# EAGLE design eLite Clock - Display Boards (EAGLE 9.6.0)
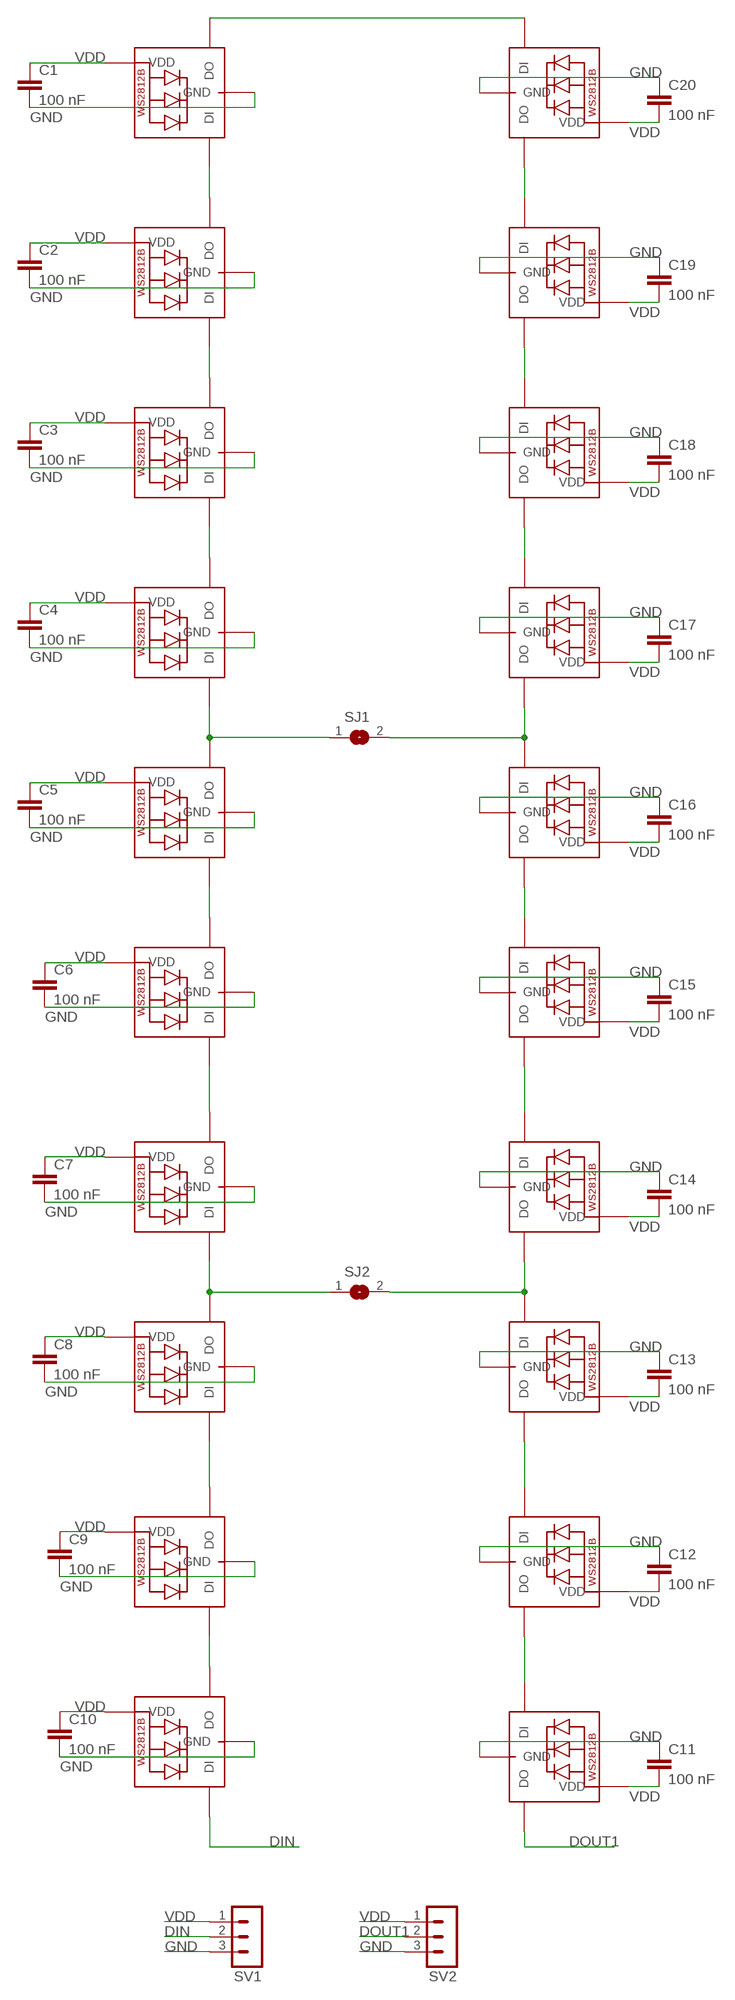
[diagram p0: schematic, sheet 1]

## Parts
C1  100 nF  C-EU025-025X050  [C025-025X050]
C2  100 nF  C-EU025-025X050  [C025-025X050]
C3  100 nF  C-EU025-025X050  [C025-025X050]
C4  100 nF  C-EU025-025X050  [C025-025X050]
C5  100 nF  C-EU025-025X050  [C025-025X050]
C6  100 nF  C-EU025-025X050  [C025-025X050]
C7  100 nF  C-EU025-025X050  [C025-025X050]
C8  100 nF  C-EU025-025X050  [C025-025X050]
C9  100 nF  C-EU025-025X050  [C025-025X050]
C10  100 nF  C-EU025-025X050  [C025-025X050]
C11  100 nF  C-EU025-025X050  [C025-025X050]
C12  100 nF  C-EU025-025X050  [C025-025X050]
C13  100 nF  C-EU025-025X050  [C025-025X050]
C14  100 nF  C-EU025-025X050  [C025-025X050]
C15  100 nF  C-EU025-025X050  [C025-025X050]
C16  100 nF  C-EU025-025X050  [C025-025X050]
C17  100 nF  C-EU025-025X050  [C025-025X050]
C18  100 nF  C-EU025-025X050  [C025-025X050]
C19  100 nF  C-EU025-025X050  [C025-025X050]
C20  100 nF  C-EU025-025X050  [C025-025X050]
LED1  WS2812B_5050W  [WS2812B-WIDE]
LED2  WS2812B_5050W  [WS2812B-WIDE]
LED3  WS2812B_5050W  [WS2812B-WIDE]
LED4  WS2812B_5050W  [WS2812B-WIDE]
LED5  WS2812B_5050W  [WS2812B-WIDE]
LED6  WS2812B_5050W  [WS2812B-WIDE]
LED7  WS2812B_5050W  [WS2812B-WIDE]
LED8  WS2812B_5050W  [WS2812B-WIDE]
LED9  WS2812B_5050W  [WS2812B-WIDE]
LED10  WS2812B_5050W  [WS2812B-WIDE]
LED11  WS2812B_5050W  [WS2812B-WIDE]
LED12  WS2812B_5050W  [WS2812B-WIDE]
LED13  WS2812B_5050W  [WS2812B-WIDE]
LED14  WS2812B_5050W  [WS2812B-WIDE]
LED15  WS2812B_5050W  [WS2812B-WIDE]
LED16  WS2812B_5050W  [WS2812B-WIDE]
LED17  WS2812B_5050W  [WS2812B-WIDE]
LED18  WS2812B_5050W  [WS2812B-WIDE]
LED19  WS2812B_5050W  [WS2812B-WIDE]
LED20  WS2812B_5050W  [WS2812B-WIDE]
SJ1  SJ  [SJ]
SJ2  SJ  [SJ]
SV1  MA03-1  [MA03-1]
SV2  MA03-1  [MA03-1]

## Nets
DIN: LED1.4-DIN(DI) SV1.2
DOUT1: LED20.2-DOUT(DO) SV2.2
GND: C1.2 C2.2 C3.2 C4.2 C5.2 C6.2 C7.2 C8.2 C9.2 C10.2 C11.1 C12.1 C13.1 C14.1 C15.1 C16.1 C17.1 C18.1 C19.1 C20.1 LED1.3-GND(GND) LED2.3-GND(GND) LED3.3-GND(GND) LED4.3-GND(GND) LED5.3-GND(GND) LED6.3-GND(GND) LED7.3-GND(GND) LED8.3-GND(GND) LED9.3-GND(GND) LED10.3-GND(GND) LED11.3-GND(GND) LED12.3-GND(GND) LED13.3-GND(GND) LED14.3-GND(GND) LED15.3-GND(GND) LED16.3-GND(GND) LED17.3-GND(GND) LED18.3-GND(GND) LED19.3-GND(GND) LED20.3-GND(GND) SV1.3 SV2.3
N$1: LED1.2-DOUT(DO) LED2.4-DIN(DI)
N$2: LED2.2-DOUT(DO) LED3.4-DIN(DI)
N$3: LED3.2-DOUT(DO) LED4.4-DIN(DI) SJ2.1
N$4: LED4.2-DOUT(DO) LED5.4-DIN(DI)
N$5: LED5.2-DOUT(DO) LED6.4-DIN(DI)
N$6: LED6.2-DOUT(DO) LED7.4-DIN(DI) SJ1.1
N$7: LED7.2-DOUT(DO) LED8.4-DIN(DI)
N$8: LED8.2-DOUT(DO) LED9.4-DIN(DI)
N$9: LED9.2-DOUT(DO) LED10.4-DIN(DI)
N$10: LED11.2-DOUT(DO) LED12.4-DIN(DI)
N$11: LED12.2-DOUT(DO) LED13.4-DIN(DI)
N$12: LED13.2-DOUT(DO) LED14.4-DIN(DI)
N$13: LED14.2-DOUT(DO) LED15.4-DIN(DI) SJ1.2
N$14: LED15.2-DOUT(DO) LED16.4-DIN(DI)
N$15: LED16.2-DOUT(DO) LED17.4-DIN(DI)
N$16: LED17.2-DOUT(DO) LED18.4-DIN(DI) SJ2.2
N$17: LED18.2-DOUT(DO) LED19.4-DIN(DI)
N$18: LED19.2-DOUT(DO) LED20.4-DIN(DI)
N$19: LED10.2-DOUT(DO) LED11.4-DIN(DI)
VDD: C1.1 C2.1 C3.1 C4.1 C5.1 C6.1 C7.1 C8.1 C9.1 C10.1 C11.2 C12.2 C13.2 C14.2 C15.2 C16.2 C17.2 C18.2 C19.2 C20.2 LED1.1-VDD(VDD) LED2.1-VDD(VDD) LED3.1-VDD(VDD) LED4.1-VDD(VDD) LED5.1-VDD(VDD) LED6.1-VDD(VDD) LED7.1-VDD(VDD) LED8.1-VDD(VDD) LED9.1-VDD(VDD) LED10.1-VDD(VDD) LED11.1-VDD(VDD) LED12.1-VDD(VDD) LED13.1-VDD(VDD) LED14.1-VDD(VDD) LED15.1-VDD(VDD) LED16.1-VDD(VDD) LED17.1-VDD(VDD) LED18.1-VDD(VDD) LED19.1-VDD(VDD) LED20.1-VDD(VDD) SV1.1 SV2.1

## Library data of the parts
C1-C20 = rcl:C-EU: CAPACITOR, European symbol; SPICEPREFIX: C
LED1-LED20 = WS2812B-WIDE:WS2812B
SJ1 SJ2 = jumper:SJ: SMD solder JUMPER
SV1 SV2 = con-lstb:MA03-1: PIN HEADER; OC_FARNELL: unknown; OC_NEWARK: unknown

## Board
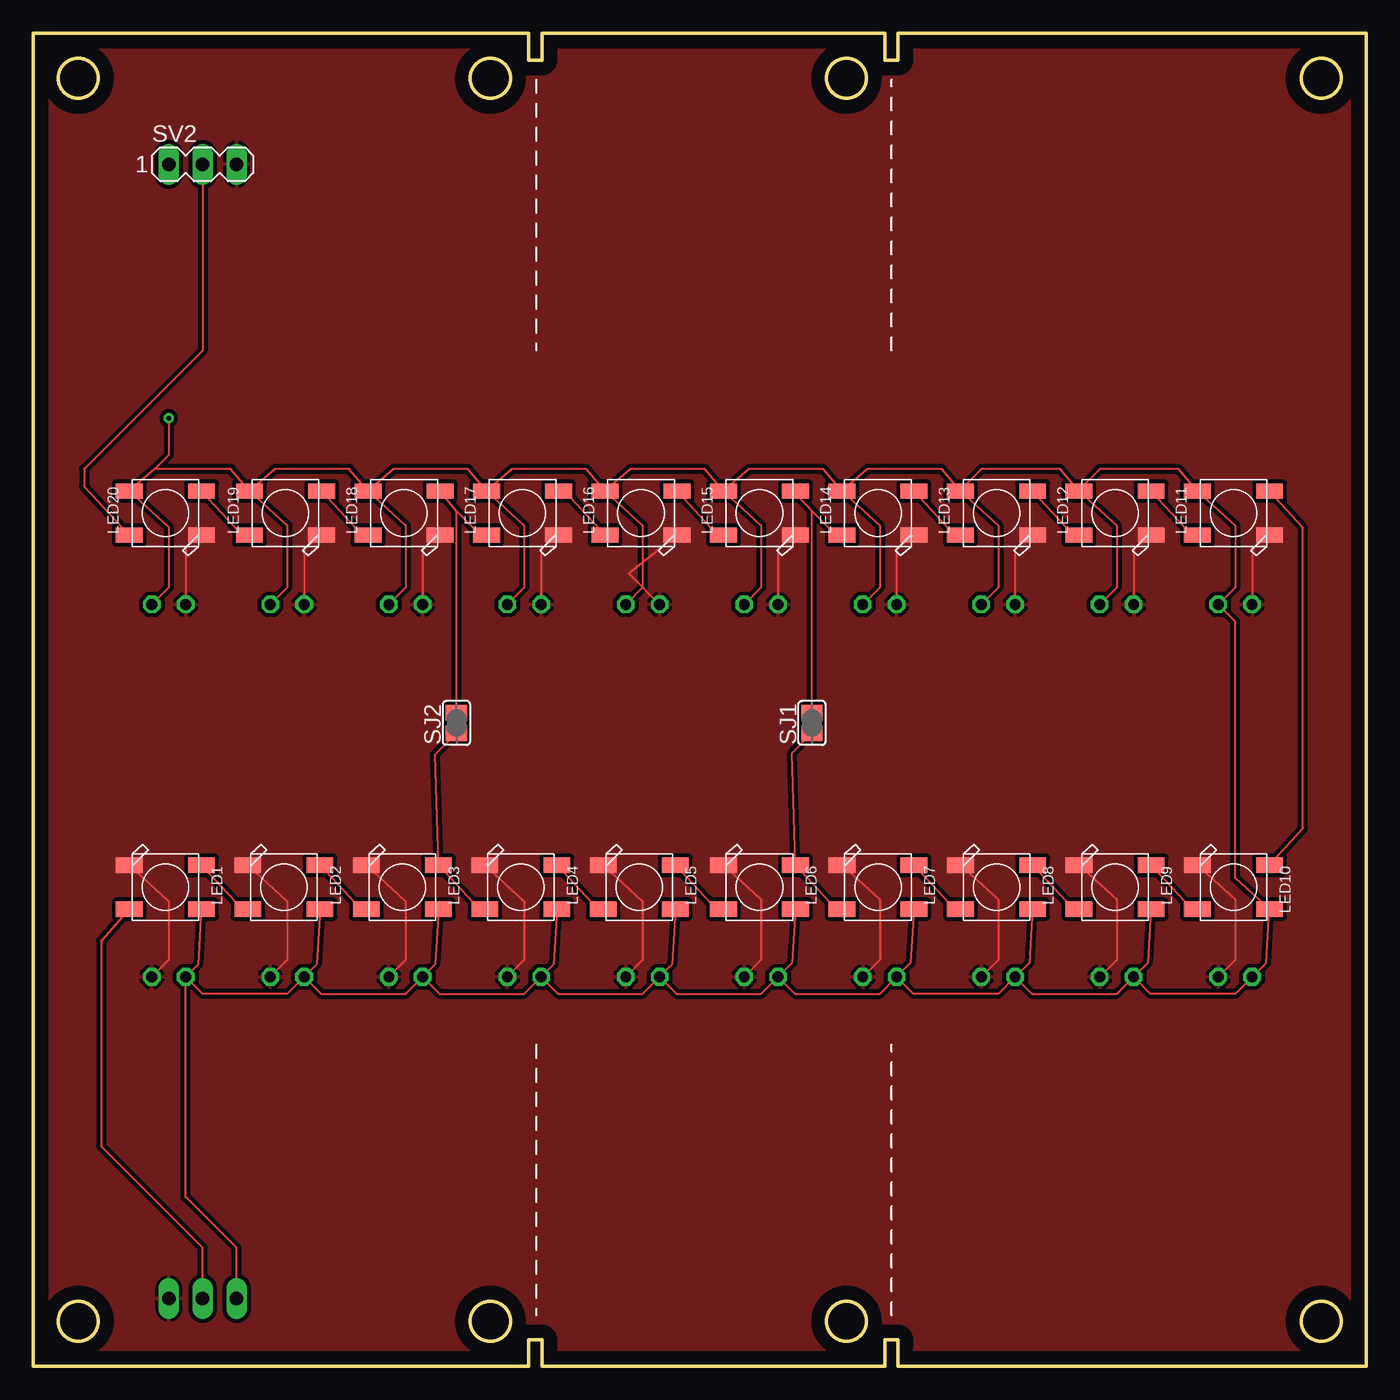
[diagram p1: board, top side]
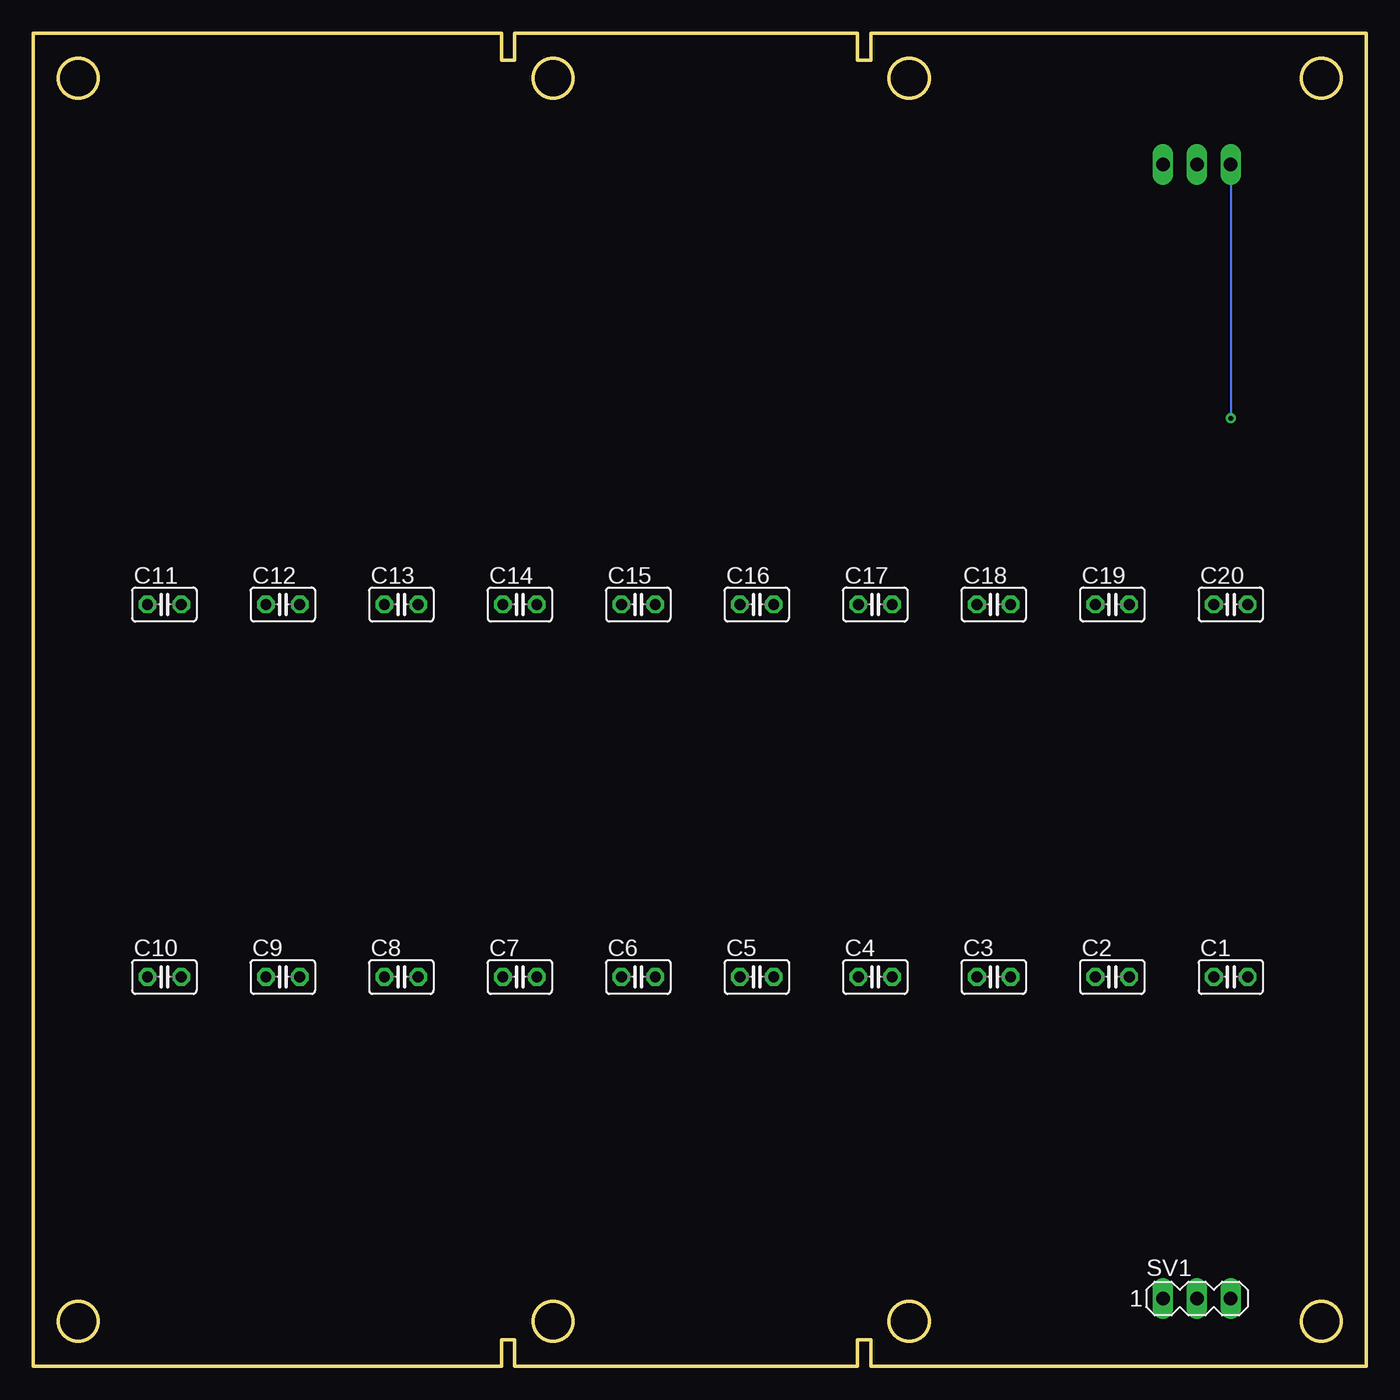
[diagram p2: board, bottom side, seen from below]

Size 100 x 100 mm. Coordinates in mm from the lower left corner, seen from the top.
Outline: 38.16,0 63.88,0 63.88,2 64.88,2 64.88,0 100,0 100,100 64.88,100 64.88,98 63.88,98 63.88,100 38.16,100 38.16,98 37.16,98 37.16,100 0,100 0,0 37.16,0 37.16,2 38.16,2 38.16,0
Outline: circle at 61.01,96.63 radius 1.5
Outline: circle at 61.01,3.37 radius 1.5
Outline: circle at 3.37,96.63 radius 1.5
Outline: circle at 3.37,3.37 radius 1.5
Outline: circle at 34.29,96.63 radius 1.5
Outline: circle at 96.63,3.37 radius 1.5
Outline: circle at 34.29,3.37 radius 1.5
Outline: circle at 96.63,96.63 radius 1.5
Copper layers (1*16): Top 0.035mm / dielectric 1.5mm / Bottom 0.035mm
Design rules "default": minimum track width 6mil, minimum drill 0.35mm, track to track 6mil, track to pad 6mil, pad to pad 6mil, via to via 6mil, smd to smd 6mil, copper to edge 40mil, drill to drill 6mil, minimum pad ring 10mil, minimum via ring 8mil, stop-mask expansion 4mil, vias tented up to drill 0mil, thermal gap 10mil

### Footprints (pad centres in the part's own frame; a part is rotated, then mirrored left to right if it is on the bottom)
C025-025X050 = drill 0.813 octagon: 1 -1.27,0; 2 1.27,0
WS2812B-WIDE = smd 2.008 x 1.154: 1-VDD 2.704,-1.65; 2-DOUT 2.704,1.65; 3-GND -2.704,1.65; 4-DIN -2.704,-1.65
SJ = smd 1.168 x 1.6: 1 -0.762,0; 2 0.762,0
MA03-1 = drill 1.016 long: 1 -2.54,0; 2 0,0; 3 2.54,0

### Placement (x,y rotation side)
C1  10.16,29.21 0 bottom
C2  19.05,29.21 0 bottom
C3  27.94,29.21 0 bottom
C4  36.83,29.21 0 bottom
C5  45.72,29.21 0 bottom
C6  54.61,29.21 0 bottom
C7  63.5,29.21 0 bottom
C8  72.39,29.21 0 bottom
C9  81.28,29.21 0 bottom
C10  90.17,29.21 0 bottom
C11  90.17,57.15 0 bottom
C12  81.28,57.15 0 bottom
C13  72.39,57.15 0 bottom
C14  63.5,57.15 0 bottom
C15  54.61,57.15 0 bottom
C16  45.72,57.15 0 bottom
C17  36.83,57.15 0 bottom
C18  27.94,57.15 0 bottom
C19  19.05,57.15 0 bottom
C20  10.16,57.15 0 bottom
LED1  9.91,35.94 0 top
LED2  18.8,35.94 0 top
LED3  27.69,35.94 0 top
LED4  36.58,35.94 0 top
LED5  45.47,35.94 0 top
LED6  54.48,35.94 0 top
LED7  63.37,35.94 0 top
LED8  72.26,35.94 0 top
LED9  81.15,35.94 0 top
LED10  90.04,35.94 0 top
LED11  90.04,64.01 180 top
LED12  81.15,64.01 180 top
LED13  72.26,64.01 180 top
LED14  63.37,64.01 180 top
LED15  54.48,64.01 180 top
LED16  45.59,64.01 180 top
LED17  36.7,64.01 180 top
LED18  27.81,64.01 180 top
LED19  18.92,64.01 180 top
LED20  9.91,64.01 180 top
SJ1  58.42,48.26 90 top
SJ2  31.75,48.26 90 top
SV1  12.7,5.08 0 bottom
SV2  12.7,90.17 0 top

### Tracks (layer width: path | path; a pad name or v marks a point on that pad's centre or on a via)
DIN
  Top 0.152: LED1.4-DIN 5.08,31.91 5.08,16.51 12.7,8.89 SV1.2
DOUT1
  Top 0.152: SV2.2 12.7,76.2 3.81,67.31 3.81,66 LED20.2-DOUT
GND
  Top 0.152: LED20.3-GND 11.43,61.43 C20.1 | LED19.3-GND 20.32,61.3 C19.1 | LED18.3-GND 29.21,61.3 C18.1 | LED17.3-GND 38.1,61.3 C17.1 | LED16.3-GND 44.69,59.45 C16.1 | LED15.3-GND 55.88,61.3 C15.1 | LED14.3-GND 64.77,61.3 C14.1 | LED13.3-GND 73.66,61.3 C13.1 | LED12.3-GND 82.55,61.3 C12.1 | LED11.3-GND 91.44,61.3 C11.1 | LED10.3-GND 90.17,35.01 90.17,30.48 C10.2 | LED9.3-GND 81.28,35.01 81.28,30.48 C9.2 | LED8.3-GND 72.39,35.01 72.39,30.48 C8.2 | LED7.3-GND 63.5,35.01 63.5,30.48 C7.2 | LED6.3-GND 54.61,35.01 54.61,30.48 C6.2 | LED5.3-GND 45.72,34.89 45.72,30.48 C5.2 | LED4.3-GND 36.83,34.89 36.83,30.48 C4.2 | LED3.3-GND 27.94,34.89 27.94,30.48 C3.2 | LED2.3-GND 19.05,34.89 19.05,30.48 C2.2 | LED1.3-GND 10.16,34.89 10.16,30.48 C1.2
  pour Top (isolate 0.305): 0,0 0,100.33 100.33,100.33 100.33,0
N$1
  Top 0.152: LED1.2-DOUT 15.66,34.29 LED2.4-DIN
N$2
  Top 0.152: LED2.2-DOUT 24.55,34.29 LED3.4-DIN
N$3
  Top 0.152: LED4.4-DIN 33.44,34.29 LED3.2-DOUT 30.14,45.88 SJ2.1
N$4
  Top 0.152: LED4.2-DOUT 42.33,34.29 LED5.4-DIN
N$5
  Top 0.152: LED5.2-DOUT 51.22,34.29 52.07,34.29 LED6.4-DIN
N$6
  Top 0.152: LED7.4-DIN 60.23,34.29 LED6.2-DOUT 56.93,46.01 SJ1.1
N$7
  Top 0.152: LED7.2-DOUT 69.12,34.29 LED8.4-DIN
N$8
  Top 0.152: LED8.2-DOUT 78.01,34.29 LED9.4-DIN
N$9
  Top 0.152: LED9.2-DOUT 86.9,34.29 LED10.4-DIN
N$10
  Top 0.152: LED11.2-DOUT 86.9,62.36 LED12.4-DIN
N$11
  Top 0.152: LED12.2-DOUT 78.01,62.36 LED13.4-DIN
N$12
  Top 0.152: LED13.2-DOUT 69.12,62.36 LED14.4-DIN
N$13
  Top 0.152: LED14.2-DOUT 60.23,62.36 58.42,64.17 | SJ1.2 58.42,64.17 | 58.42,64.17 58.17,64.42 58.17,64.47 56.98,65.66 LED15.4-DIN
N$14
  Top 0.152: LED15.2-DOUT 51.34,62.36 LED16.4-DIN
N$15
  Top 0.152: LED16.2-DOUT 39.84,65.66 LED17.4-DIN
N$16
  Top 0.152: LED17.2-DOUT 33.56,62.36 31.75,64.17 | SJ2.2 31.75,64.17 | 31.75,64.17 LED18.4-DIN
N$17
  Top 0.152: LED18.2-DOUT 24.67,62.36 LED19.4-DIN
N$18
  Top 0.152: LED19.2-DOUT 15.66,62.36 LED20.4-DIN
N$19
  Top 0.152: LED11.4-DIN 95.25,62.9 95.25,40.35 LED10.2-DOUT
VDD  (via drill 0.35)
  Top 0.152: LED9.1-VDD 83.6,30.26 C9.1 | LED8.1-VDD 74.71,30.26 C8.1 | LED7.1-VDD 65.82,30.26 C7.1 | LED6.1-VDD 56.93,30.26 C6.1 | LED5.1-VDD 47.92,30.14 C5.1 | LED4.1-VDD 39.03,30.14 C4.1 | LED3.1-VDD 30.14,30.14 C3.1 | LED2.1-VDD 21.25,30.14 C2.1 | LED1.1-VDD 12.36,30.14 C1.1 | C20.2 10.16,58.42 10.16,62.95 LED20.1-VDD 9.11,67.31 | LED19.1-VDD 19.05,63.08 19.05,58.42 C19.2 | LED18.1-VDD 27.94,63.08 27.94,58.42 C18.2 | LED17.1-VDD 36.83,63.08 36.83,58.42 C17.2 | LED16.1-VDD 45.72,63.08 45.72,58.42 C16.2 | LED15.1-VDD 54.61,63.08 54.61,58.42 C15.2 | LED14.1-VDD 63.5,63.08 63.5,58.42 C14.2 | LED13.1-VDD 72.39,63.08 72.39,58.42 C13.2 | LED12.1-VDD 81.28,63.08 81.28,58.42 C12.2 | C1.1 11.43,12.7 15.24,8.89 SV1.1 | C9.1 83.82,27.94 90.17,27.94 C10.1 92.49,30.26 LED10.1-VDD 90.17,36.61 90.17,55.88 C11.2 90.17,58.42 90.17,63.08 LED11.1-VDD 85.94,67.31 80.01,67.31 78.7,66 LED12.1-VDD | C8.1 74.93,27.94 81.28,27.94 C9.1 | C8.1 72.39,27.94 66.04,27.94 C7.1 | C6.1 57.15,27.94 63.5,27.94 C7.1 | C5.1 48.26,27.94 54.61,27.94 C6.1 | C4.1 39.37,27.94 45.72,27.94 C5.1 | C3.1 30.48,27.94 36.83,27.94 C4.1 | C2.1 21.59,27.94 27.94,27.94 C3.1 | C2.1 19.05,27.94 12.7,27.94 C1.1 | LED12.1-VDD 77.05,67.31 71.12,67.31 69.81,66 LED13.1-VDD | LED13.1-VDD 68.16,67.31 62.58,67.31 LED14.1-VDD | LED14.1-VDD 59.27,67.31 53.69,67.31 LED15.1-VDD | LED15.1-VDD 50.38,67.31 44.8,67.31 LED16.1-VDD | LED16.1-VDD 41.49,67.31 35.91,67.31 LED17.1-VDD | LED17.1-VDD 32.6,67.31 27.02,67.31 LED18.1-VDD | LED18.1-VDD 23.71,67.31 18.12,67.31 LED19.1-VDD | LED19.1-VDD 14.82,67.31 9.11,67.31 | v10.16,71.12 10.16,68.36 9.11,67.31
  Bottom 0.152: SV2.1 v10.16,71.12